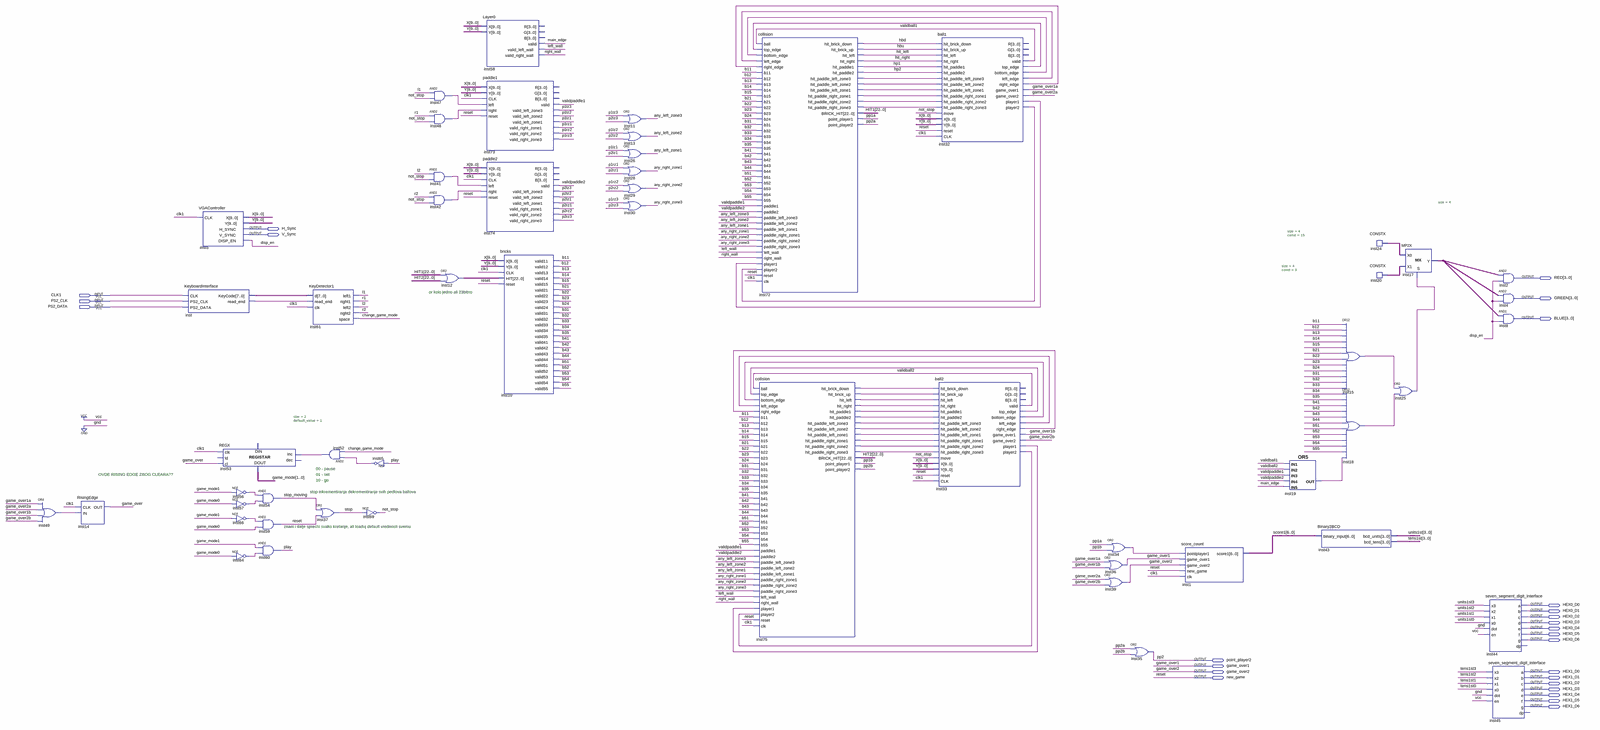
[diagram p0: schematic sheet, whole]
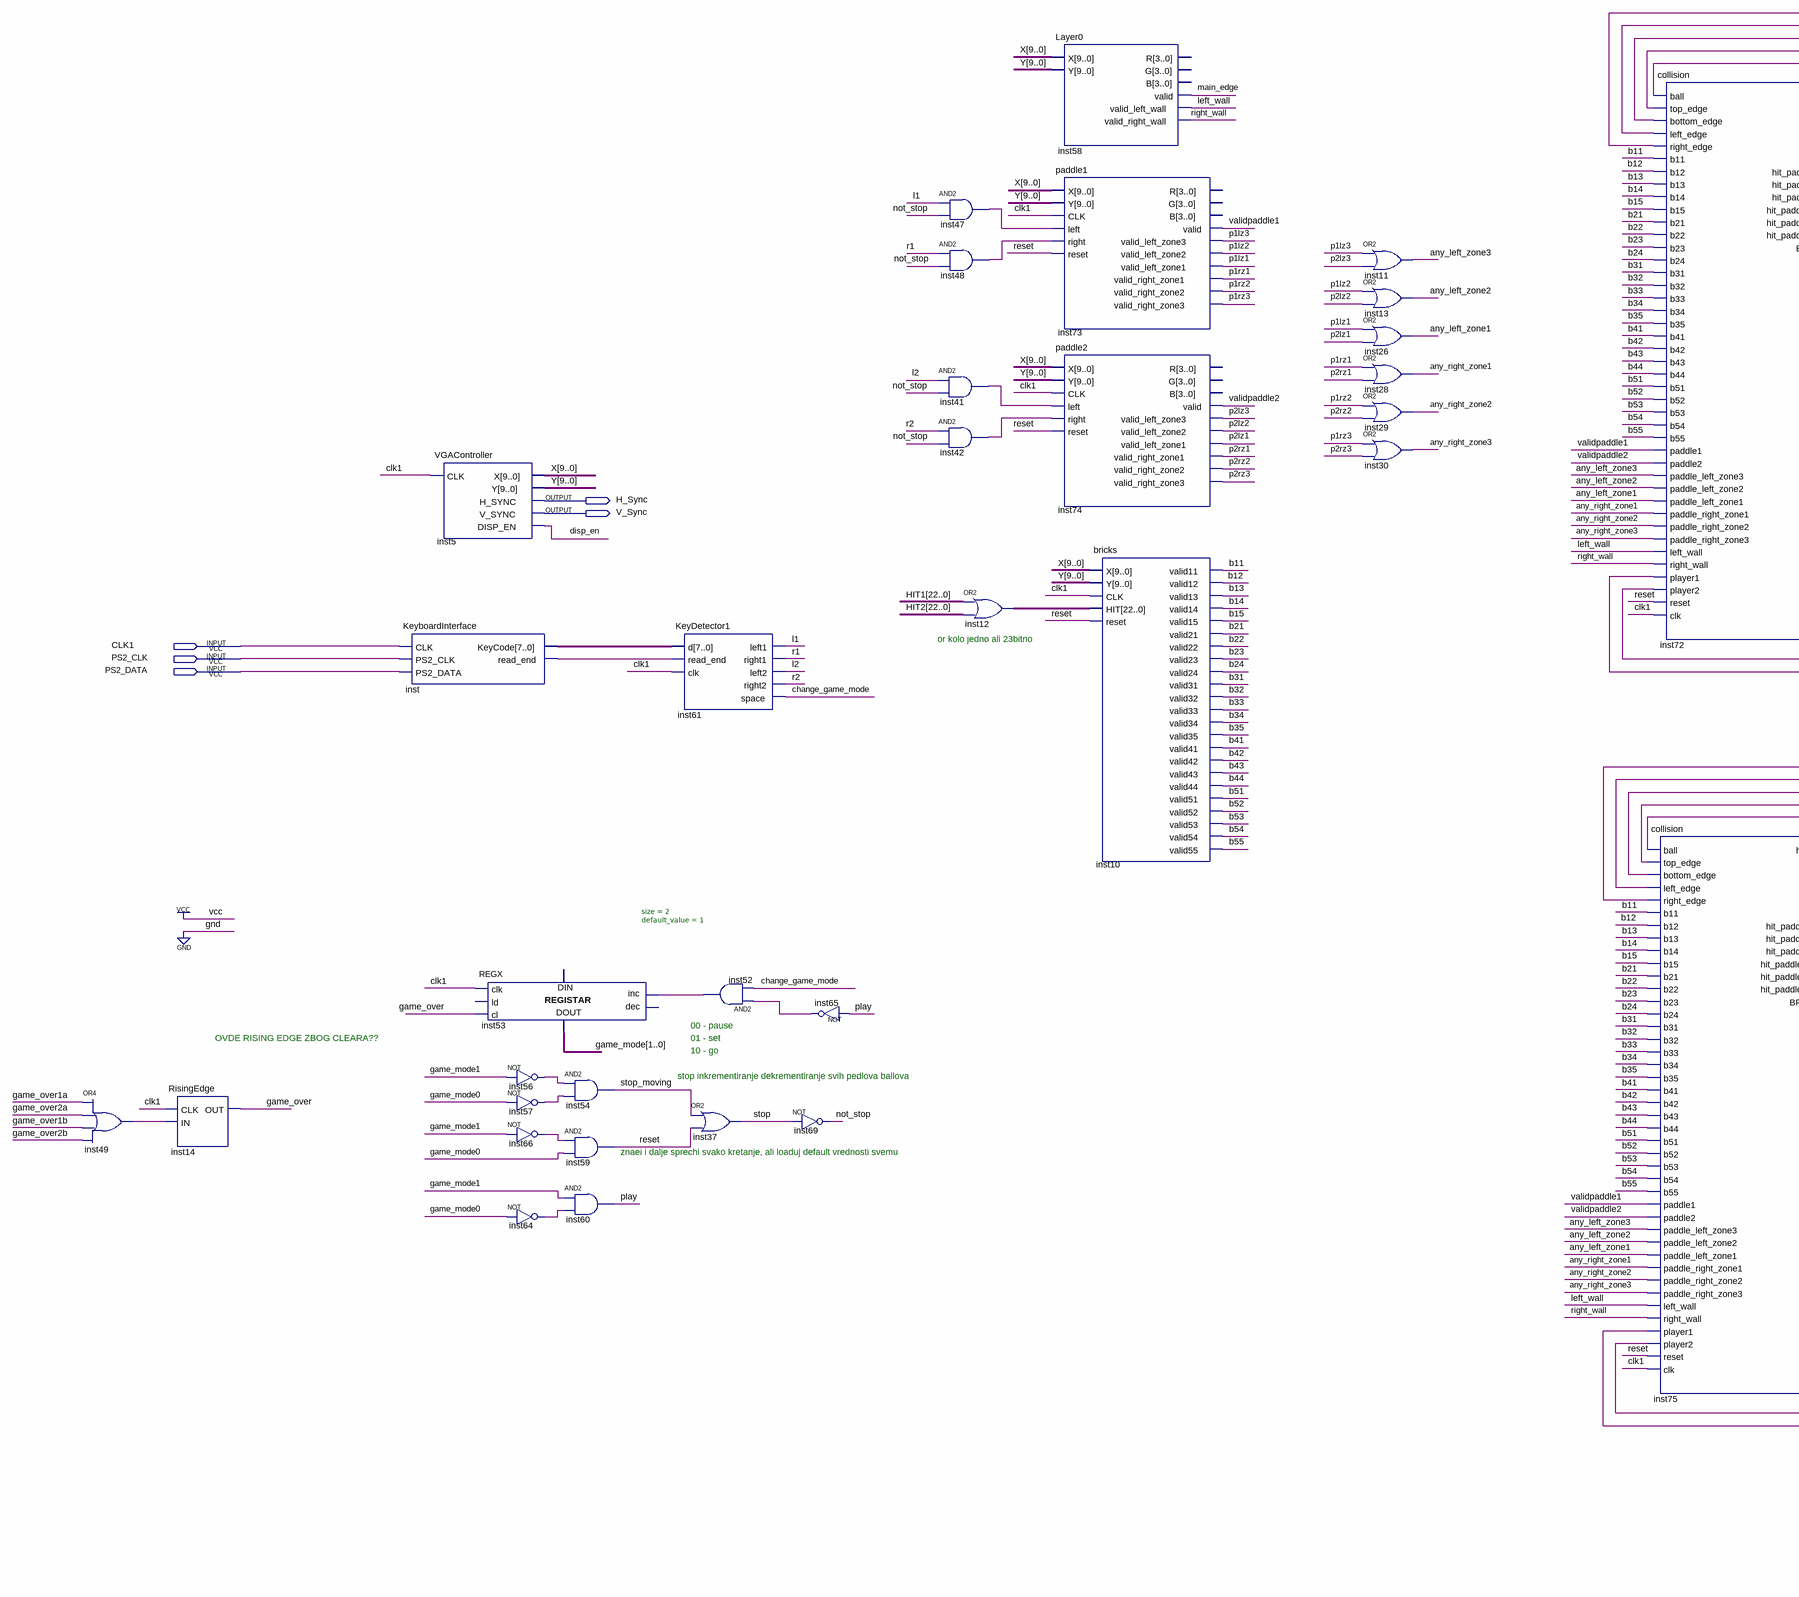
[diagram p1: schematic sheet, left part]
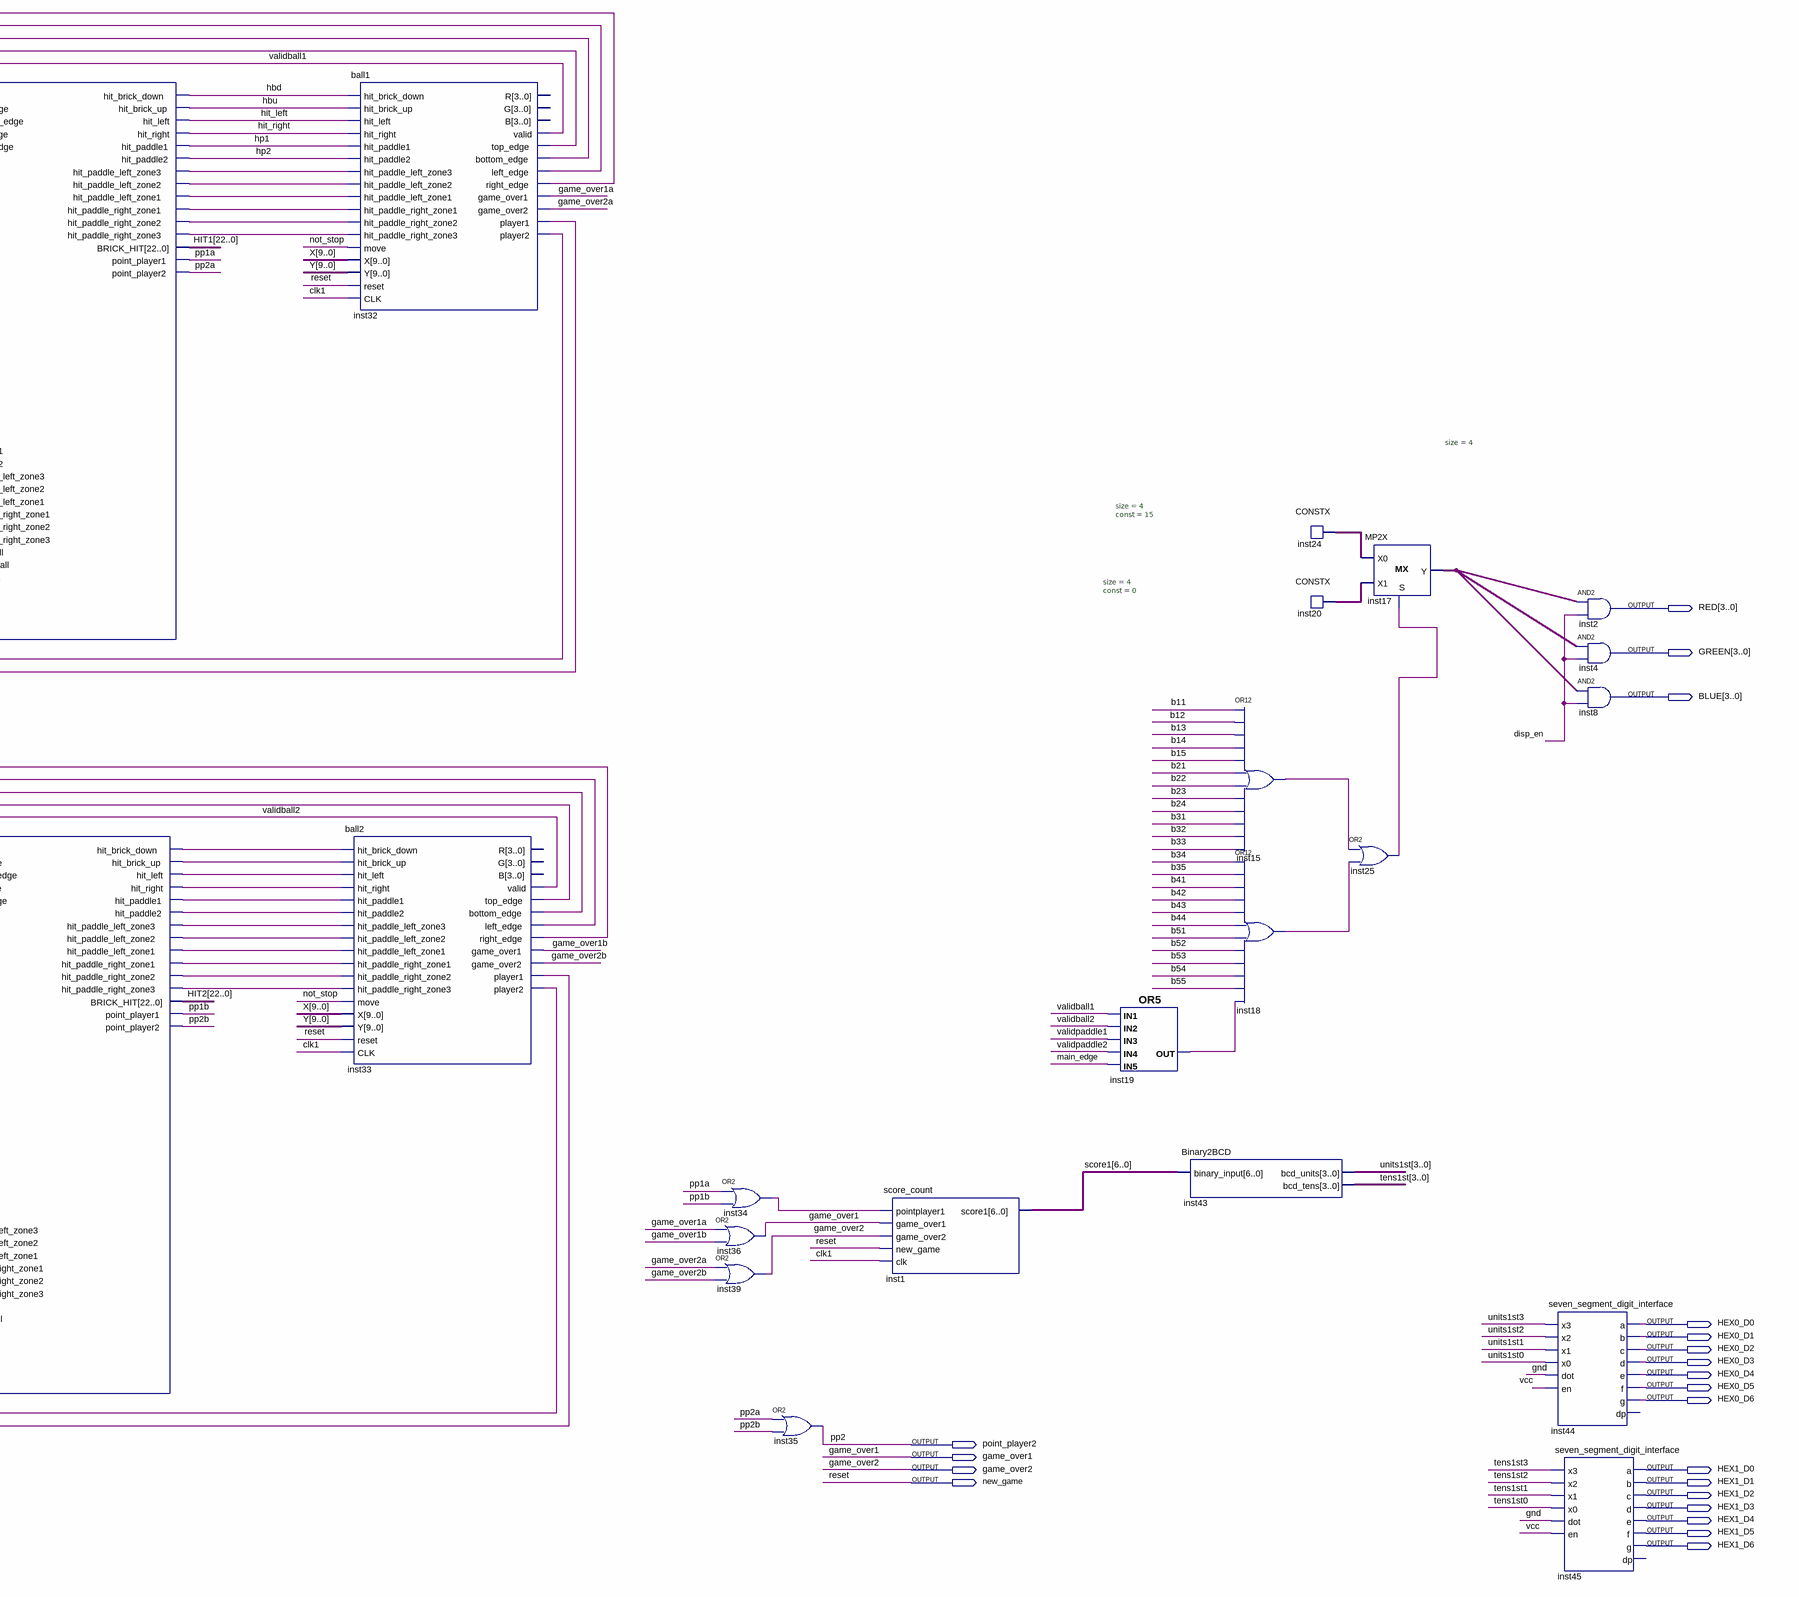
[diagram p2: schematic sheet, right part]
// Quartus schematic main.bdf as structural Verilog: 54 symbols, 26 pins
module main (
  input  CLK1,
  input  PS2_CLK,
  input  PS2_DATA,
  output H_Sync,
  output V_Sync,
  output [3:0] RED,
  output [3:0] GREEN,
  output [3:0] BLUE,
  output HEX0_D0,
  output HEX0_D1,
  output HEX0_D2,
  output HEX0_D3,
  output HEX0_D4,
  output HEX0_D5,
  output HEX0_D6,
  output point_player2,
  output game_over1,
  output game_over2,
  output HEX1_D0,
  output new_game,
  output HEX1_D1,
  output HEX1_D2,
  output HEX1_D3,
  output HEX1_D4,
  output HEX1_D5,
  output HEX1_D6
);

  wire any_left_zone1, any_left_zone2, any_left_zone3, any_right_zone1, any_right_zone2, any_right_zone3,
       b11, b12, b13, b14, b15, b21, b22, b23, b24, b31, b32, b33, b34, b35, b41, b42, b43, b44, b51, b52,
       b53, b54, b55, change_game_mode, disp_en, game_over, game_over1a, game_over1b, game_over2a,
       game_over2b, hbd, hbu, hit_left, hit_right, hp1, hp2, inst15_out, inst18_out, inst19_out, inst25_out,
       inst32_bottom_edge, inst32_left_edge, inst32_player1, inst32_player2, inst32_right_edge,
       inst32_top_edge, inst33_bottom_edge, inst33_left_edge, inst33_player1, inst33_player2,
       inst33_right_edge, inst33_top_edge, inst34_out, inst41_out, inst42_out, inst47_out, inst48_out,
       inst49_out, inst52_out, inst56_out, inst57_out, inst64_out, inst65_out, inst66_out,
       inst72_hit_paddle_left_zone1, inst72_hit_paddle_left_zone2, inst72_hit_paddle_left_zone3,
       inst72_hit_paddle_right_zone1, inst72_hit_paddle_right_zone2, inst72_hit_paddle_right_zone3,
       inst75_hit_brick_down, inst75_hit_brick_up, inst75_hit_left, inst75_hit_paddle1, inst75_hit_paddle2,
       inst75_hit_paddle_left_zone1, inst75_hit_paddle_left_zone2, inst75_hit_paddle_left_zone3,
       inst75_hit_paddle_right_zone1, inst75_hit_paddle_right_zone2, inst75_hit_paddle_right_zone3,
       inst75_hit_right, inst_read_end, l1, l2, left_wall, main_edge, not_stop, p1lz1, p1lz2, p1lz3, p1rz1,
       p1rz2, p1rz3, p2lz1, p2lz2, p2lz3, p2rz1, p2rz2, p2rz3, play, pp1a, pp1b, pp2a, pp2b, r1, r2,
       right_wall, stop, stop_moving, validball1, validball2, validpaddle1, validpaddle2;
  wire [1:0] game_mode;
  wire [3:0] inst17_y, inst20_data, inst24_data, tens1st, units1st;
  wire [6:0] score1;
  wire [7:0] inst_keycode;
  wire [9:0] X, Y;
  wire [22:0] HIT1, HIT2, inst12_out;

  or inst49 (inst49_out, game_over1a, game_over2a, game_over1b, game_over2b);
  RisingEdge inst14 (.CLK(CLK1), .IN(inst49_out), .OUT(game_over));
  KeyboardInterface inst (
    .CLK(CLK1), .PS2_CLK(PS2_CLK), .PS2_DATA(PS2_DATA), .KeyCode(inst_keycode), .read_end(inst_read_end));
  VGAController inst5 (.CLK(CLK1), .X(X), .Y(Y), .H_SYNC(H_Sync), .V_SYNC(V_Sync), .DISP_EN(disp_en));
  REGX #(.size(2), .default_value(1)) inst53 (
    .clk(CLK1), .cl(game_over), .inc(inst52_out), .data_out(game_mode));  // open: ld, dec, data_in
  not inst56 (inst56_out, game_mode[1]);
  not inst57 (inst57_out, game_mode[0]);
  not inst66 (inst66_out, game_mode[1]);
  not inst64 (inst64_out, game_mode[0]);
  and inst54 (stop_moving, inst56_out, inst57_out);
  and inst59 (new_game, inst66_out, game_mode[0]);
  and inst60 (play, game_mode[1], inst64_out);
  KeyDetector1 inst61 (
    .d(inst_keycode), .read_end(inst_read_end), .clk(CLK1), .left1(l1), .right1(r1), .left2(l2), .right2(r2),
    .space(change_game_mode));
  and inst52 (inst52_out, inst65_out, change_game_mode);
  or inst37 (stop, stop_moving, new_game);
  not inst65 (inst65_out, play);
  not inst69 (not_stop, stop);
  and inst47 (inst47_out, l1, not_stop);
  and inst48 (inst48_out, r1, not_stop);
  and inst41 (inst41_out, l2, not_stop);
  and inst42 (inst42_out, r2, not_stop);
  assign inst12_out = HIT1 | HIT2;  // OR2 inst12, 23 bits wide
  Layer0 inst58 (
    .X(X), .Y(Y), .valid(main_edge), .valid_left_wall(left_wall), .valid_right_wall(right_wall));  // open: R, G, B
  paddle1 inst73 (
    .X(X), .Y(Y), .CLK(CLK1), .left(inst47_out), .right(inst48_out), .reset(new_game), .valid(validpaddle1),
    .valid_left_zone3(p1lz3), .valid_left_zone2(p1lz2), .valid_left_zone1(p1lz1), .valid_right_zone1(p1rz1),
    .valid_right_zone2(p1rz2), .valid_right_zone3(p1rz3));  // open: R, G, B
  paddle2 inst74 (
    .X(X), .Y(Y), .CLK(CLK1), .left(inst41_out), .right(inst42_out), .reset(new_game), .valid(validpaddle2),
    .valid_left_zone3(p2lz3), .valid_left_zone2(p2lz2), .valid_left_zone1(p2lz1), .valid_right_zone1(p2rz1),
    .valid_right_zone2(p2rz2), .valid_right_zone3(p2rz3));  // open: R, G, B
  bricks inst10 (
    .X(X), .Y(Y), .CLK(CLK1), .HIT(inst12_out), .reset(new_game), .valid11(b11), .valid12(b12),
    .valid13(b13), .valid14(b14), .valid15(b15), .valid21(b21), .valid22(b22), .valid23(b23), .valid24(b24),
    .valid31(b31), .valid32(b32), .valid33(b33), .valid34(b34), .valid35(b35), .valid41(b41), .valid42(b42),
    .valid43(b43), .valid44(b44), .valid51(b51), .valid52(b52), .valid53(b53), .valid54(b54), .valid55(b55));
  or inst11 (any_left_zone3, p1lz3, p2lz3);
  or inst13 (any_left_zone2, p1lz2, p2lz2);
  or inst26 (any_left_zone1, p1lz1, p2lz1);
  or inst28 (any_right_zone1, p1rz1, p2rz1);
  or inst29 (any_right_zone2, p1rz2, p2rz2);
  or inst30 (any_right_zone3, p1rz3, p2rz3);
  collision inst72 (
    .ball(validball1), .top_edge(inst32_top_edge), .bottom_edge(inst32_bottom_edge),
    .left_edge(inst32_left_edge), .right_edge(inst32_right_edge), .b11(b11), .b12(b12), .b13(b13), .b14(b14),
    .b15(b15), .b21(b21), .b22(b22), .b23(b23), .b24(b24), .b31(b31), .b32(b32), .b33(b33), .b34(b34),
    .b35(b35), .b41(b41), .b42(b42), .b43(b43), .b44(b44), .b51(b51), .b52(b52), .b53(b53), .b54(b54),
    .b55(b55), .paddle1(validpaddle1), .paddle2(validpaddle2), .paddle_left_zone3(any_left_zone3),
    .paddle_left_zone2(any_left_zone2), .paddle_left_zone1(any_left_zone1),
    .paddle_right_zone1(any_right_zone1), .paddle_right_zone2(any_right_zone2),
    .paddle_right_zone3(any_right_zone3), .left_wall(left_wall), .right_wall(right_wall),
    .player1(inst32_player1), .player2(inst32_player2), .reset(new_game), .clk(CLK1), .hit_brick_down(hbd),
    .hit_brick_up(hbu), .hit_left(hit_left), .hit_right(hit_right), .hit_paddle1(hp1), .hit_paddle2(hp2),
    .hit_paddle_left_zone3(inst72_hit_paddle_left_zone3),
    .hit_paddle_left_zone2(inst72_hit_paddle_left_zone2),
    .hit_paddle_left_zone1(inst72_hit_paddle_left_zone1),
    .hit_paddle_right_zone1(inst72_hit_paddle_right_zone1),
    .hit_paddle_right_zone2(inst72_hit_paddle_right_zone2),
    .hit_paddle_right_zone3(inst72_hit_paddle_right_zone3), .BRICK_HIT(HIT1), .point_player1(pp1a),
    .point_player2(pp2a));
  collision inst75 (
    .ball(validball2), .top_edge(inst33_top_edge), .bottom_edge(inst33_bottom_edge),
    .left_edge(inst33_left_edge), .right_edge(inst33_right_edge), .b11(b11), .b12(b12), .b13(b13), .b14(b14),
    .b15(b15), .b21(b21), .b22(b22), .b23(b23), .b24(b24), .b31(b31), .b32(b32), .b33(b33), .b34(b34),
    .b35(b35), .b41(b41), .b42(b42), .b43(b43), .b44(b44), .b51(b51), .b52(b52), .b53(b53), .b54(b54),
    .b55(b55), .paddle1(validpaddle1), .paddle2(validpaddle2), .paddle_left_zone3(any_left_zone3),
    .paddle_left_zone2(any_left_zone2), .paddle_left_zone1(any_left_zone1),
    .paddle_right_zone1(any_right_zone1), .paddle_right_zone2(any_right_zone2),
    .paddle_right_zone3(any_right_zone3), .left_wall(left_wall), .right_wall(right_wall),
    .player1(inst33_player1), .player2(inst33_player2), .reset(new_game), .clk(CLK1),
    .hit_brick_down(inst75_hit_brick_down), .hit_brick_up(inst75_hit_brick_up), .hit_left(inst75_hit_left),
    .hit_right(inst75_hit_right), .hit_paddle1(inst75_hit_paddle1), .hit_paddle2(inst75_hit_paddle2),
    .hit_paddle_left_zone3(inst75_hit_paddle_left_zone3),
    .hit_paddle_left_zone2(inst75_hit_paddle_left_zone2),
    .hit_paddle_left_zone1(inst75_hit_paddle_left_zone1),
    .hit_paddle_right_zone1(inst75_hit_paddle_right_zone1),
    .hit_paddle_right_zone2(inst75_hit_paddle_right_zone2),
    .hit_paddle_right_zone3(inst75_hit_paddle_right_zone3), .BRICK_HIT(HIT2), .point_player1(pp1b),
    .point_player2(pp2b));
  ball1 inst32 (
    .hit_brick_down(hbd), .hit_brick_up(hbu), .hit_left(hit_left), .hit_right(hit_right), .hit_paddle1(hp1),
    .hit_paddle2(hp2), .hit_paddle_left_zone3(inst72_hit_paddle_left_zone3),
    .hit_paddle_left_zone2(inst72_hit_paddle_left_zone2),
    .hit_paddle_left_zone1(inst72_hit_paddle_left_zone1),
    .hit_paddle_right_zone1(inst72_hit_paddle_right_zone1),
    .hit_paddle_right_zone2(inst72_hit_paddle_right_zone2),
    .hit_paddle_right_zone3(inst72_hit_paddle_right_zone3), .move(not_stop), .X(X), .Y(Y), .reset(new_game),
    .CLK(CLK1), .valid(validball1), .top_edge(inst32_top_edge), .bottom_edge(inst32_bottom_edge),
    .left_edge(inst32_left_edge), .right_edge(inst32_right_edge), .game_over1(game_over1a),
    .game_over2(game_over2a), .player1(inst32_player1), .player2(inst32_player2));  // open: R, G, B
  ball2 inst33 (
    .hit_brick_down(inst75_hit_brick_down), .hit_brick_up(inst75_hit_brick_up), .hit_left(inst75_hit_left),
    .hit_right(inst75_hit_right), .hit_paddle1(inst75_hit_paddle1), .hit_paddle2(inst75_hit_paddle2),
    .hit_paddle_left_zone3(inst75_hit_paddle_left_zone3),
    .hit_paddle_left_zone2(inst75_hit_paddle_left_zone2),
    .hit_paddle_left_zone1(inst75_hit_paddle_left_zone1),
    .hit_paddle_right_zone1(inst75_hit_paddle_right_zone1),
    .hit_paddle_right_zone2(inst75_hit_paddle_right_zone2),
    .hit_paddle_right_zone3(inst75_hit_paddle_right_zone3), .move(not_stop), .X(X), .Y(Y), .reset(new_game),
    .CLK(CLK1), .valid(validball2), .top_edge(inst33_top_edge), .bottom_edge(inst33_bottom_edge),
    .left_edge(inst33_left_edge), .right_edge(inst33_right_edge), .game_over1(game_over1b),
    .game_over2(game_over2b), .player1(inst33_player1), .player2(inst33_player2));  // open: R, G, B
  or inst34 (inst34_out, pp1a, pp1b);
  or inst36 (game_over1, game_over1a, game_over1b);
  or inst39 (game_over2, game_over2a, game_over2b);
  or inst35 (point_player2, pp2a, pp2b);
  score_count inst1 (
    .pointplayer1(inst34_out), .game_over1(game_over1), .game_over2(game_over2), .new_game(new_game),
    .clk(CLK1), .score1(score1));
  or inst19 (inst19_out, validball1, validball2, validpaddle1, validpaddle2, main_edge);
  Binary2BCD inst43 (.binary_input(score1), .bcd_units(units1st), .bcd_tens(tens1st));
  or inst15 (inst15_out, b11, b12, b13, b14, b15, b21, b22, b23, b24, b31, b32, b33);
  or inst18 (inst18_out, b34, b35, b41, b42, b43, b44, b51, b52, b53, b54, b55, inst19_out);
  CONSTX #(.size(4), .\const (15)) inst24 (.data(inst24_data));
  CONSTX #(.size(4), .\const (0)) inst20 (.data(inst20_data));
  MP2X #(.size(4)) inst17 (.S(inst25_out), .X0(inst24_data), .X1(inst20_data), .Y(inst17_y));
  or inst25 (inst25_out, inst15_out, inst18_out);
  seven_segment_digit_interface inst44 (
    .x3(units1st[3]), .x2(units1st[2]), .x1(units1st[1]), .x0(units1st[0]), .dot(1'b0), .en(1'b1),
    .a(HEX0_D0), .b(HEX0_D1), .c(HEX0_D2), .d(HEX0_D3), .e(HEX0_D4), .f(HEX0_D5), .g(HEX0_D6));  // open: dp
  assign RED = inst17_y & {4{disp_en}};  // AND2 inst2, 4 bits wide
  assign GREEN = inst17_y & {4{disp_en}};  // AND2 inst4, 4 bits wide
  assign BLUE = inst17_y & {4{disp_en}};  // AND2 inst8, 4 bits wide
  seven_segment_digit_interface inst45 (
    .x3(tens1st[3]), .x2(tens1st[2]), .x1(tens1st[1]), .x0(tens1st[0]), .dot(1'b0), .en(1'b1), .a(HEX1_D0),
    .b(HEX1_D1), .c(HEX1_D2), .d(HEX1_D3), .e(HEX1_D4), .f(HEX1_D5), .g(HEX1_D6));  // open: dp

  // Other names for the same wires on the sheet: pp2 = point_player2; reset = new_game

  // Notes on the sheet:
  //   or kolo jedno ali 23bitno
  //   00 - pause
  //   OVDE RISING EDGE ZBOG CLEARA??
  //   01 - set
  //   10 - go
  //   stop inkrementiranje dekrementiranje svih pedlova ballova
  //   znaei i dalje sprechi svako kretanje, ali loaduj default vrednosti svemu 
endmodule
